# EAGLE schematic COMPLETE_W_COLORS (EAGLE 7.5.0)
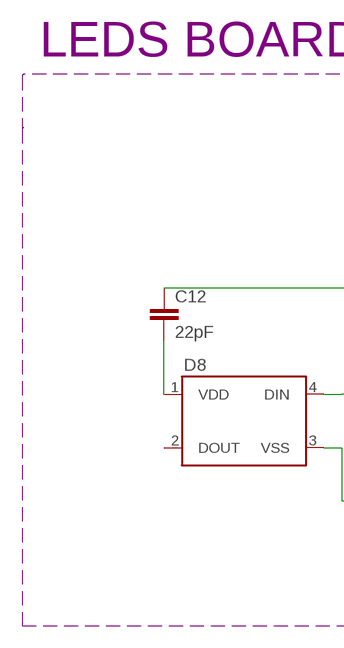
[diagram p0: schematic, sheet 1, part 1 of 2]
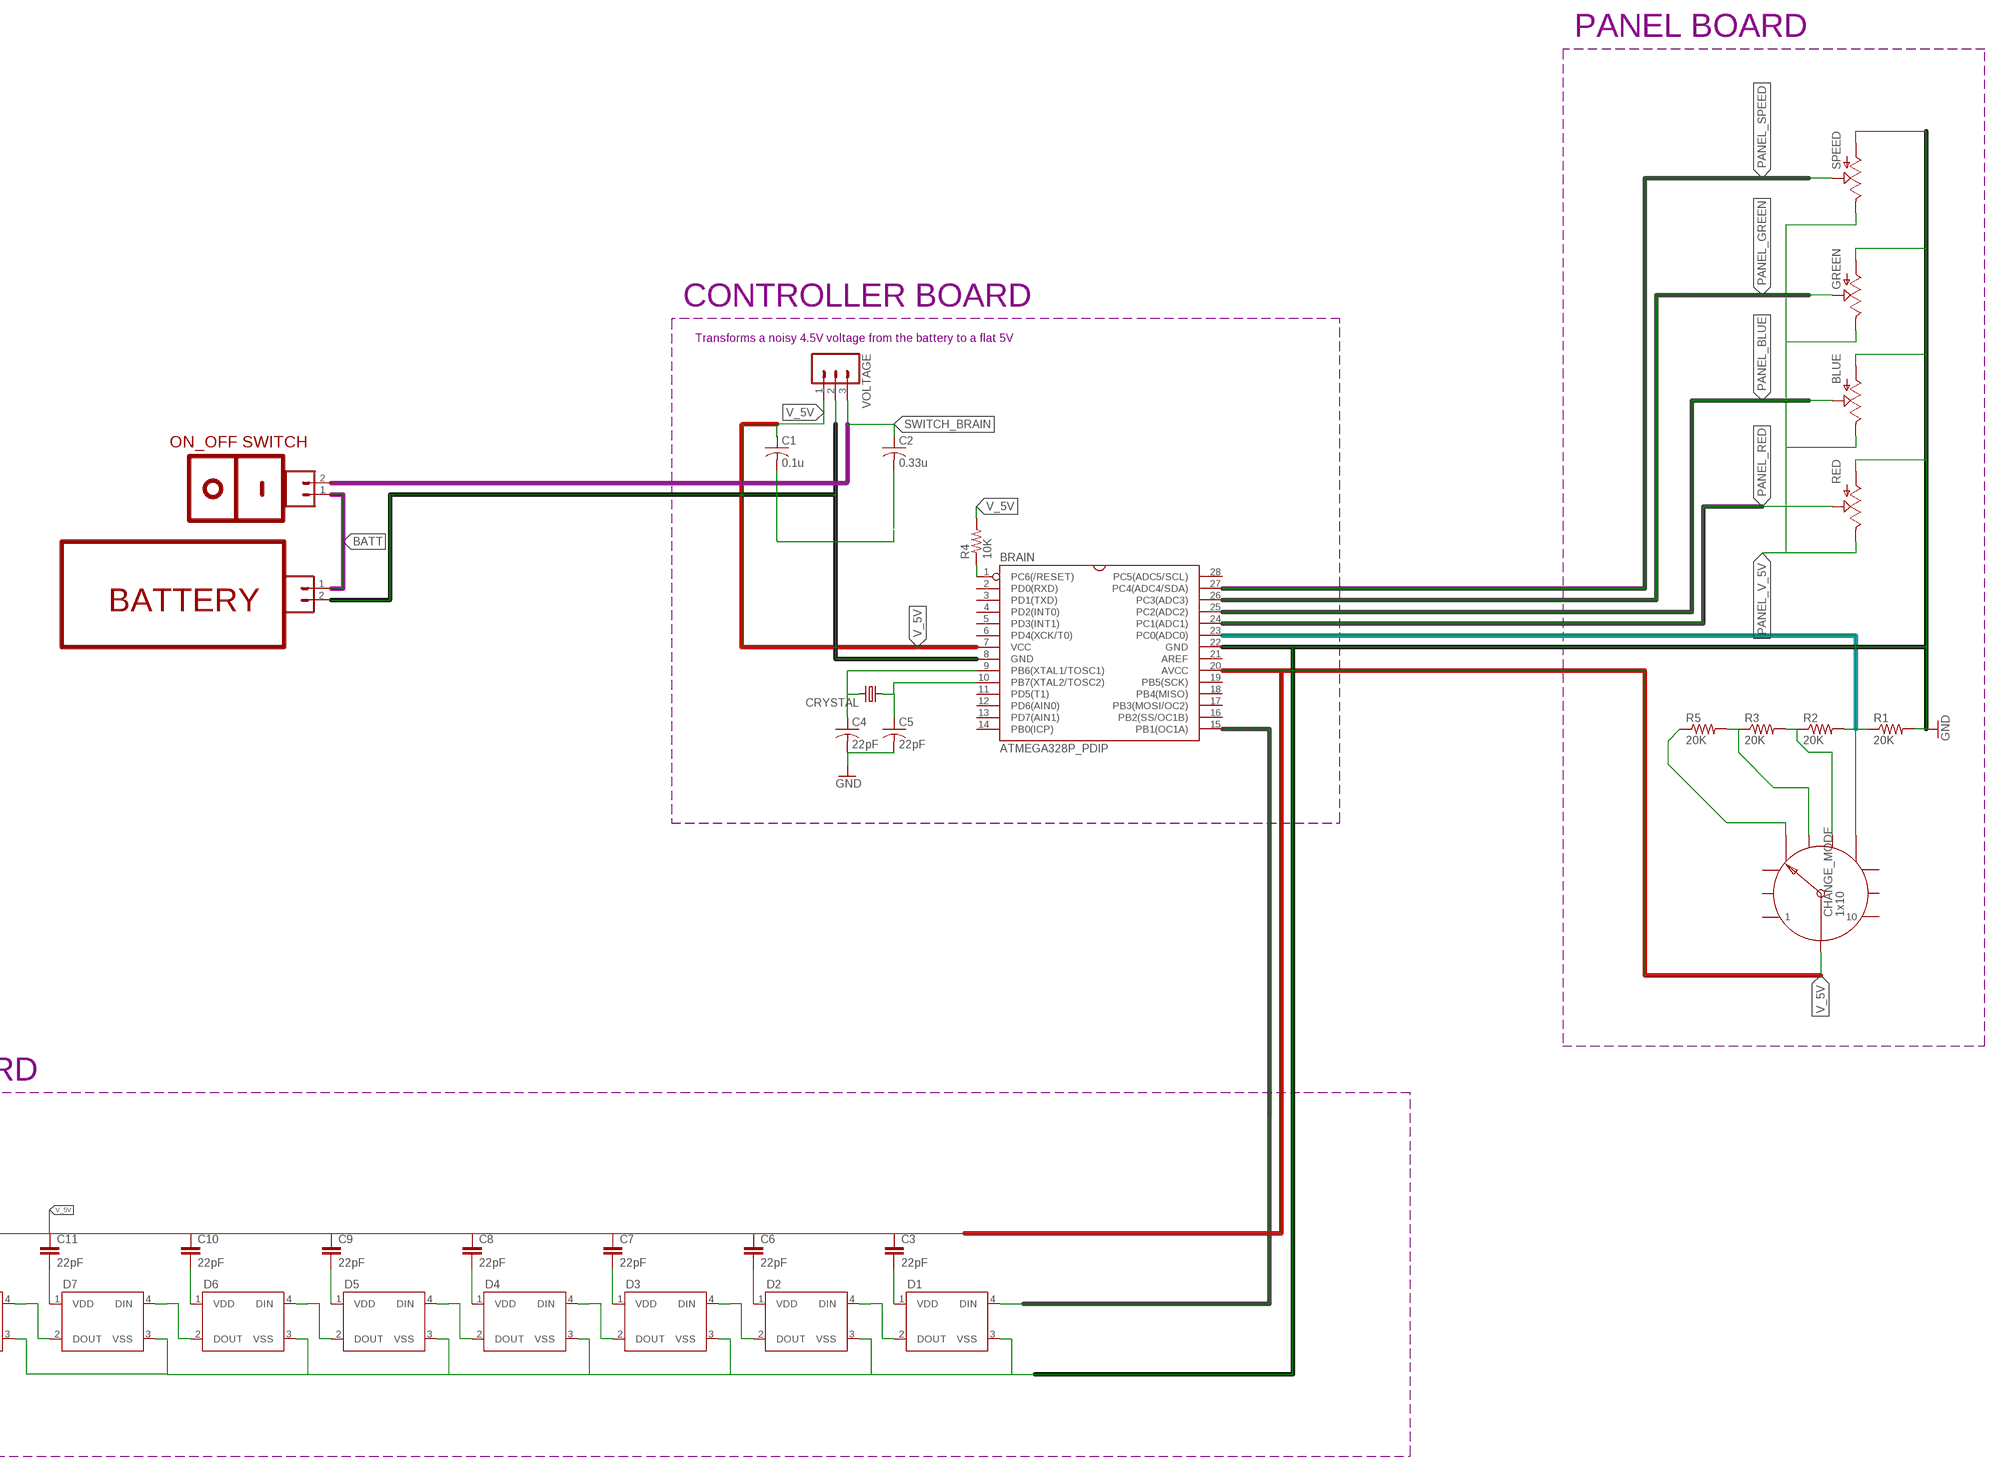
[diagram p1: schematic, sheet 1, part 2 of 2]

## Parts
BATTERY  M02PTH  [1X02]
BLUE  POT-RV16AF-20  [POT_ALPHA_RV16AF-20]
BRAIN  ATMEGA328P_PDIP  [DIL-28-3]
C1  0.1u  C-US025-025X050  [C025-025X050]
C2  0.33u  C-US025-025X050  [C025-025X050]
C3  22pF  CAP1206  [1206]
C4  22pF  C-US025-024X044  [C025-024X044]
C5  22pF  C-US025-024X044  [C025-024X044]
C6  22pF  CAP1206  [1206]
C7  22pF  CAP1206  [1206]
C8  22pF  CAP1206  [1206]
C9  22pF  CAP1206  [1206]
C10  22pF  CAP1206  [1206]
C11  22pF  CAP1206  [1206]
C12  22pF  CAP1206  [1206]
CHANGE_MODE  1x10  SWITCH_ROTARY_1X10  [ROTARY_SWITCH_1X10]
CRYSTAL  CRYSTALHC49US  [HC49US]
D1  WS2812B  [WS2812B]
D2  WS2812B  [WS2812B]
D3  WS2812B  [WS2812B]
D4  WS2812B  [WS2812B]
D5  WS2812B  [WS2812B]
D6  WS2812B  [WS2812B]
D7  WS2812B  [WS2812B]
D8  WS2812B  [WS2812B]
GREEN  POT-RV16AF-20  [POT_ALPHA_RV16AF-20]
ON_OFF  M02-JST-2-PTH-NO_SILK  [JST-2-PTH-NS]
R1  20K  RESISTOR1206  [1206]
R2  20K  RESISTOR1206  [1206]
R3  20K  RESISTOR1206  [1206]
R4  10K  RESISTOR1206  [1206]
R5  20K  RESISTOR1206  [1206]
RED  POT-RV16AF-20  [POT_ALPHA_RV16AF-20]
SPEED  POT-RV16AF-20  [POT_ALPHA_RV16AF-20]
VOLTAGE  M03PTH  [1X03]

## Nets
BATT: BATTERY.1 ON_OFF.1
GND: BATTERY.2 BLUE.1(A) BRAIN.8(GND) BRAIN.22(GND) C4.2 C5.2 D1.3(VSS) D2.3(VSS) D3.3(VSS) D4.3(VSS) D5.3(VSS) D6.3(VSS) D7.3(VSS) D8.3(VSS) GREEN.1(A) R1.2 RED.1(A) SPEED.1(A) VOLTAGE.2
LEDS_LAMP: D1.4(DIN)
N$1: BRAIN.15(PB1(OC1A))
N$2: CHANGE_MODE.4 R5.1
N$3: CHANGE_MODE.5 R3.1 R5.2
N$4: CHANGE_MODE.6 R2.1 R3.2
N$6: C2.2
N$7: BRAIN.9(PB6(XTAL1/TOSC1)) C4.1 CRYSTAL.2
N$8: BRAIN.10(PB7(XTAL2/TOSC2)) C5.1 CRYSTAL.1
N$9: D1.2(DOUT)
N$11: C1.2
N$12: C3.2 D1.1(VDD)
N$13: D2.2(DOUT)
N$14: C6.2 D2.1(VDD)
N$16: D2.4(DIN)
N$17: D3.2(DOUT)
N$18: C7.2 D3.1(VDD)
N$20: D3.4(DIN)
N$21: D4.2(DOUT)
N$22: C8.2 D4.1(VDD)
N$24: D4.4(DIN)
N$25: D5.2(DOUT)
N$26: C9.2 D5.1(VDD)
N$28: D5.4(DIN)
N$29: D6.2(DOUT)
N$30: C10.2 D6.1(VDD)
N$32: D6.4(DIN)
N$33: D7.2(DOUT)
N$34: C11.2 D7.1(VDD)
N$36: D7.4(DIN)
N$38: C12.2 D8.1(VDD)
N$40: D8.4(DIN)
PANEL_BLUE: BLUE.2(S) BRAIN.25(PC2(ADC2))
PANEL_GREEN: BRAIN.26(PC3(ADC3)) GREEN.2(S)
PANEL_MODE: CHANGE_MODE.7 R1.1 R2.2
PANEL_RED: BRAIN.24(PC1(ADC1)) RED.2(S)
PANEL_SPEED: BRAIN.27(PC4(ADC4/SDA)) SPEED.2(S)
PANEL_V_5V: BLUE.3(E) GREEN.3(E) RED.3(E) SPEED.3(E)
RST: BRAIN.1(PC6(/RESET)) R4.1
SPEED_BRAIN: BRAIN.23(PC0(ADC0))
SWITCH_BRAIN: C2.1 VOLTAGE.3
V_5V: BRAIN.7(VCC) BRAIN.20(AVCC) C1.1 C3.1 C6.1 C7.1 C8.1 C9.1 C10.1 C11.1 C12.1 CHANGE_MODE.COMMON R4.2 VOLTAGE.1
Unconnected: BRAIN.2(PD0(RXD)) BRAIN.3(PD1(TXD)) BRAIN.4(PD2(INT0)) BRAIN.5(PD3(INT1)) BRAIN.6(PD4(XCK/T0)) BRAIN.11(PD5(T1)) BRAIN.12(PD6(AIN0)) BRAIN.13(PD7(AIN1)) BRAIN.14(PB0(ICP)) BRAIN.16(PB2(SS/OC1B)) BRAIN.17(PB3(MOSI/OC2)) BRAIN.18(PB4(MISO)) BRAIN.19(PB5(SCK)) BRAIN.21(AREF) BRAIN.28(PC5(ADC5/SCL)) CHANGE_MODE.1 CHANGE_MODE.2 CHANGE_MODE.3 CHANGE_MODE.8 CHANGE_MODE.9 CHANGE_MODE.10 D8.2(DOUT) ON_OFF.2

## Notes on the sheet
- PANEL BOARD
- CONTROLLER BOARD | Transforms a noisy 4.5V voltage from the battery to a flat 5V
- ON_OFF SWITCH
- BATTERY
- LEDS BOARD

## Library data of the parts
BATTERY ON_OFF = SparkFun-Connectors:M02: Standard 2-pin 0.1" header. Use with - straight break away headers ( PRT-00116) - right angle break away headers (PRT-00553) - swiss pins (PRT-00743) - machine pins (PRT-00117) - female headers (PRT-00115) Molex polarized connector foot print use with: PRT-08233 with associated crimp pins and housings. 2.54_SCREWTERM for use with PRT-10571. 3.5mm Screw Terminal footprints for PRT-08084 5mm Screw Terminal footprints for use with PRT-08432
BLUE GREEN RED SPEED = SparkFun-Electromechanical:POT
BRAIN = RodrigoMarques_Parts:ATMEGA328P_PDIP: uC used in the Arduino 32kb flash, 1k EEPROM, 2k SRAM This is the through-hole version of this chip.
C1 C2 C4 C5 = adafruit:C-US: CAPACITOR, American symbol
C3 C6-C12 = SparkFun-Capacitors:CAP: Capacitor Standard 0603 ceramic capacitor, and 0.1" leaded capacitor.
CHANGE_MODE = SparkFun-Electromechanical:SWITCH_ROTARY_1X10: SWCH-12120; PROD_ID: SWCH-12120
CRYSTAL = SparkFun-FreqCtrl:CRYSTAL: Various standard crystals. Proven footprints.
D1-D8 = SparkFun-LED:WS2812B: WS2812B - Intelligent control LED integrated light source Technical Specifications: Power Supply Voltage (VDD): 3.5 to 5.3 V Input Voltage (VI): -0.5 to VDD+0.5 V Operating Junction Temperature (Topt): -25°C to +80°C Storage Temperature Range (Tstg): -55°C to +150°C; PROD_ID: DIO-12503
R1-R5 = SparkFun-Resistors:RESISTOR: Resistor Basic schematic elements and footprints for 0603, 1206, and PTH resistors.
VOLTAGE = SparkFun-Connectors:M03: Header 3 Standard 3-pin 0.1" header. Use with straight break away headers (SKU : PRT-00116), right angle break away headers (PRT-00553), swiss pins (PRT-00743), machine pins (PRT-00117), and female headers (PRT-00115). Molex polarized connector foot print use with SKU : PRT-08232 with associated crimp pins and housings.

## Net classes
0 default: width 0.254 mm